# EAGLE design brain (EAGLE 9.6.1)
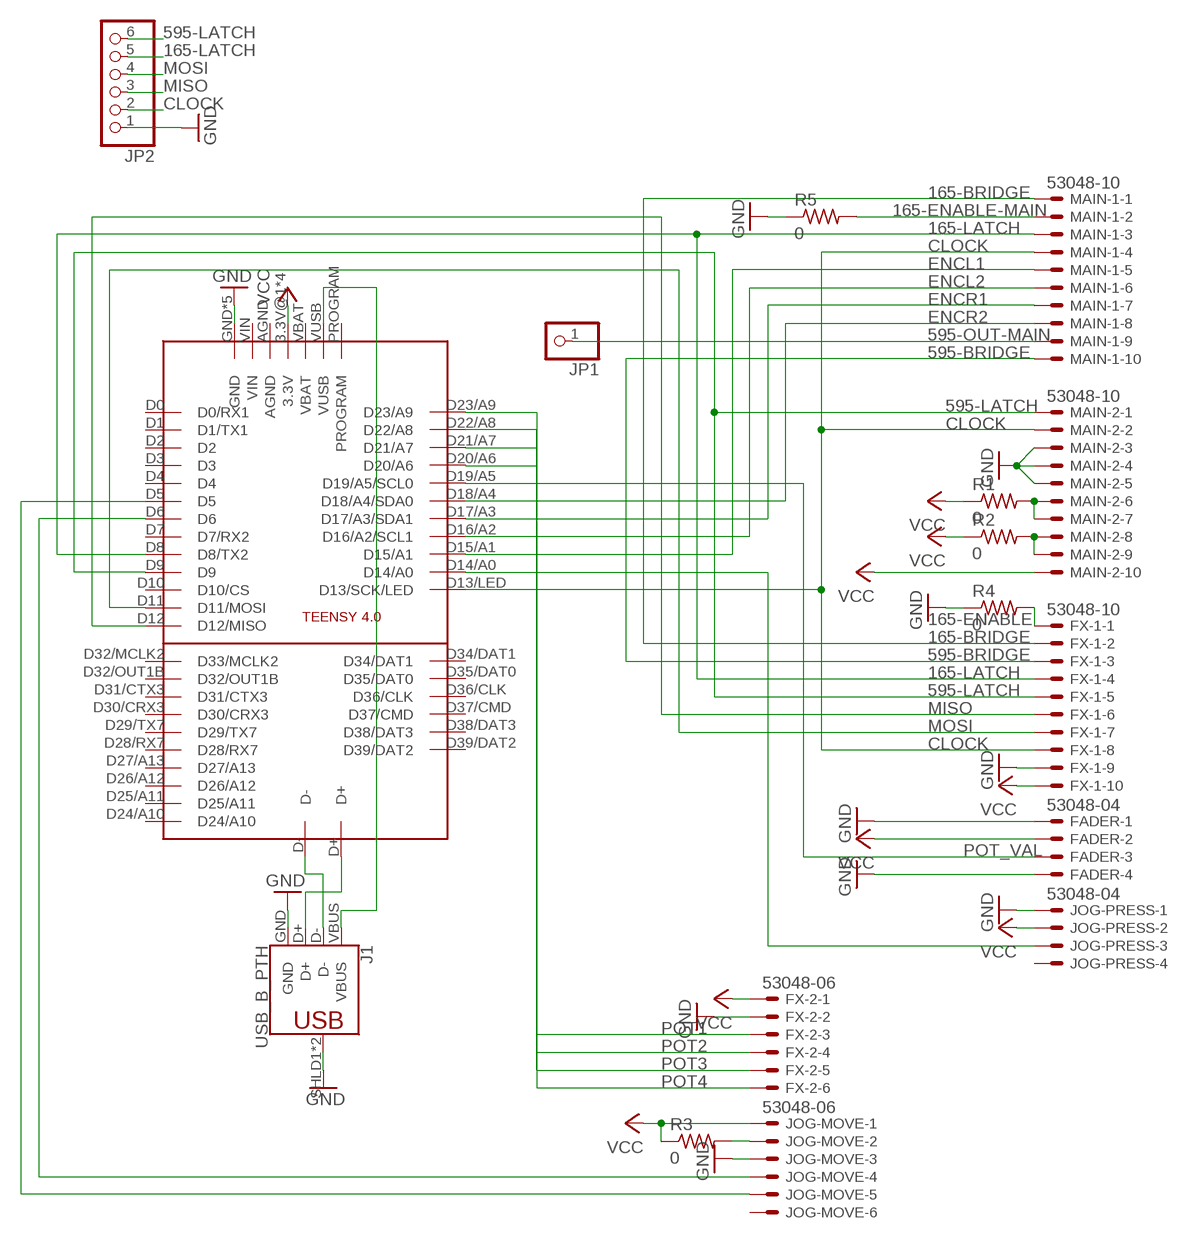
[diagram p0: schematic, sheet 1]

## Parts
FADER  53048-04  [53048-04]
FX-1  53048-10  [53048-10]
FX-2  53048-06  [53048-06]
J1  USB_B_PTH  [USB-B-PTH]
JOG-MOVE  53048-06  [53048-06]
JOG-PRESS  53048-04  [53048-04]
JP1  PINHD-1X1  [1X01]
JP2  PINHD-1X6  [1X06]
MAIN-1  53048-10  [53048-10]
MAIN-2  53048-10  [53048-10]
R1  0  R-US_R1206  [R1206]
R2  0  R-US_R1206  [R1206]
R3  0  R-US_R1206  [R1206]
R4  0  R-US_R1206  [R1206]
R5  0  R-US_R1206  [R1206]
U$1  TEENSY-4.0-FULL-BRAKE-PADS  [TEENSY-4.0-FULL-BRAKE-PADS]

## Nets
165-BRIDGE: FX-1.2 MAIN-1.1
165-ENABLE: FX-1.1 R4.2
165-ENABLE-MAIN: MAIN-1.2 R5.2
165-LATCH: FX-1.4 JP2.5 MAIN-1.3 U$1.D8(D8/TX2)
595-BRIDGE: FX-1.3 MAIN-1.10
595-LATCH: FX-1.5 JP2.6 MAIN-2.1 U$1.D9
595-OUT-MAIN: JP1.1 MAIN-1.9
CLOCK: FX-1.8 JP2.2 MAIN-1.4 MAIN-2.2 U$1.D13/LED(D13/SCK/LED)
ENCL1: MAIN-1.5 U$1.D15/A1
ENCL2: MAIN-1.6 U$1.D16/A2(D16/A2/SCL1)
ENCR1: MAIN-1.7 U$1.D17/A3(D17/A3/SDA1)
ENCR2: MAIN-1.8 U$1.D18/A4(D18/A4/SDA0)
GND: FADER.1 FADER.4 FX-1.9 FX-2.2 J1.GND J1.SHLD1(SHIELD) J1.SHLD2(SHIELD) JOG-MOVE.3 JOG-PRESS.1 JP2.1 MAIN-2.3 MAIN-2.4 MAIN-2.5 R4.1 R5.1 U$1.GND U$1.GND@1(GND) U$1.GND@2(GND) U$1.P$11(GND) U$1.P$12(GND)
MISO: FX-1.6 JP2.3 U$1.D12(D12/MISO)
MOSI: FX-1.7 JP2.4 U$1.D11(D11/MOSI)
N$1: MAIN-2.8 MAIN-2.9 R2.2
N$2: MAIN-2.6 MAIN-2.7 R1.2
N$3: JOG-PRESS.3 U$1.D14/A0
N$4: JOG-MOVE.2 R3.2
N$5: JOG-MOVE.4 U$1.D6
N$6: JOG-MOVE.5 U$1.D5
N$7: J1.D+ U$1.D+
N$8: J1.D- U$1.D-
N$9: J1.VBUS U$1.VUSB
POT1: FX-2.3 U$1.D20/A6
POT2: FX-2.4 U$1.D21/A7
POT3: FX-2.5 U$1.D22/A8
POT4: FX-2.6 U$1.D23/A9
POT_VAL: FADER.3 U$1.D19/A5(D19/A5/SCL0)
VCC: FADER.2 FX-1.10 FX-2.1 JOG-MOVE.1 JOG-PRESS.2 MAIN-2.10 R1.1 R2.1 R3.1 U$1.3.3V@1(3.3V) U$1.3.3V@2(3.3V) U$1.3V3(3.3V) U$1.ON/OFF(3.3V)
Unconnected: JOG-MOVE.6 JOG-PRESS.4 U$1.AGND U$1.D0(D0/RX1) U$1.D1(D1/TX1) U$1.D2 U$1.D3 U$1.D4 U$1.D7(D7/RX2) U$1.D10(D10/CS) U$1.D24/A10 U$1.D25/A11 U$1.D26/A12 U$1.D27/A13 U$1.D28/RX7 U$1.D29/TX7 U$1.D30/CRX3 U$1.D31/CTX3 U$1.D32/MCLK2(D33/MCLK2) U$1.D32/OUT1B U$1.D34/DAT1 U$1.D35/DAT0 U$1.D36/CLK U$1.D37/CMD U$1.D38/DAT3 U$1.D39/DAT2 U$1.PROGRAM U$1.VBAT U$1.VIN

## Library data of the parts
FADER JOG-PRESS = con-molex:53?-04: CONNECTOR wire to board 1.25 mm (.049 inch) pitch header; MF: MOLEX; MPN: 53048-0410; OC_FARNELL: 1462887; OC_NEWARK: 57H4721
FX-1 MAIN-1 MAIN-2 = con-molex:53?-10: CONNECTOR wire to board 1.25 mm (.049 inch) pitch header; MF: MOLEX; MPN: 53048-1010; OC_FARNELL: 9733108; OC_NEWARK: 98K9838
FX-2 JOG-MOVE = con-molex:53?-06: CONNECTOR wire to board 1.25 mm (.049 inch) pitch header; MF: WALDOM/MOLEX; MPN: 53048-0610; OC_FARNELL: 1012260; OC_NEWARK: 38C9911
J1 = SparkFun-Connectors:USB_B: USB Type B Connector SparkFun Products: SparkFun Stepoko <https://www.sparkfun.com/products/13899> PTH; PROD_ID: CONN-08278; SF_ID: PRT-00139
JP1 = pinhead:PINHD-1X1: PIN HEADER
JP2 = pinhead:PINHD-1X6: PIN HEADER
R1-R5 = adafruit:R-US_: RESISTOR, American symbol
U$1 = Teensy-4.0:TEENSY-4.0-FULL-BRAKE-PADS

## Board
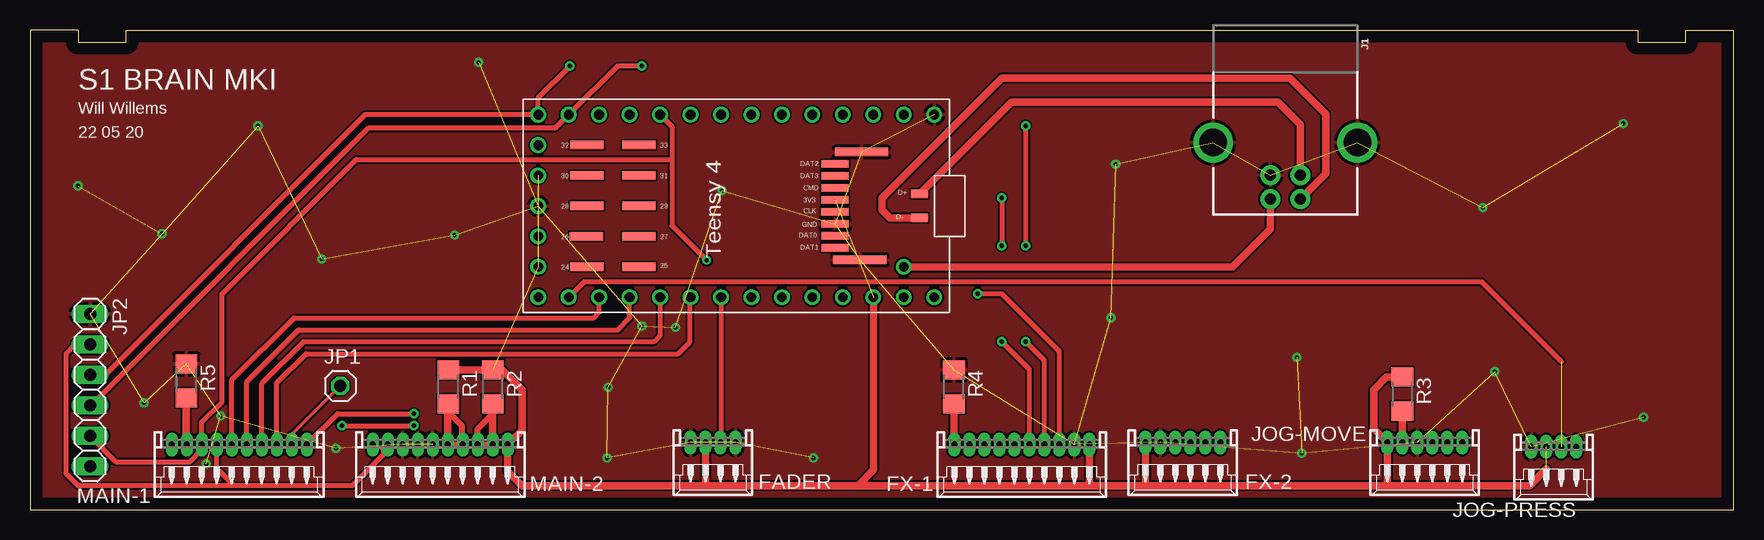
[diagram p1: board, top side]
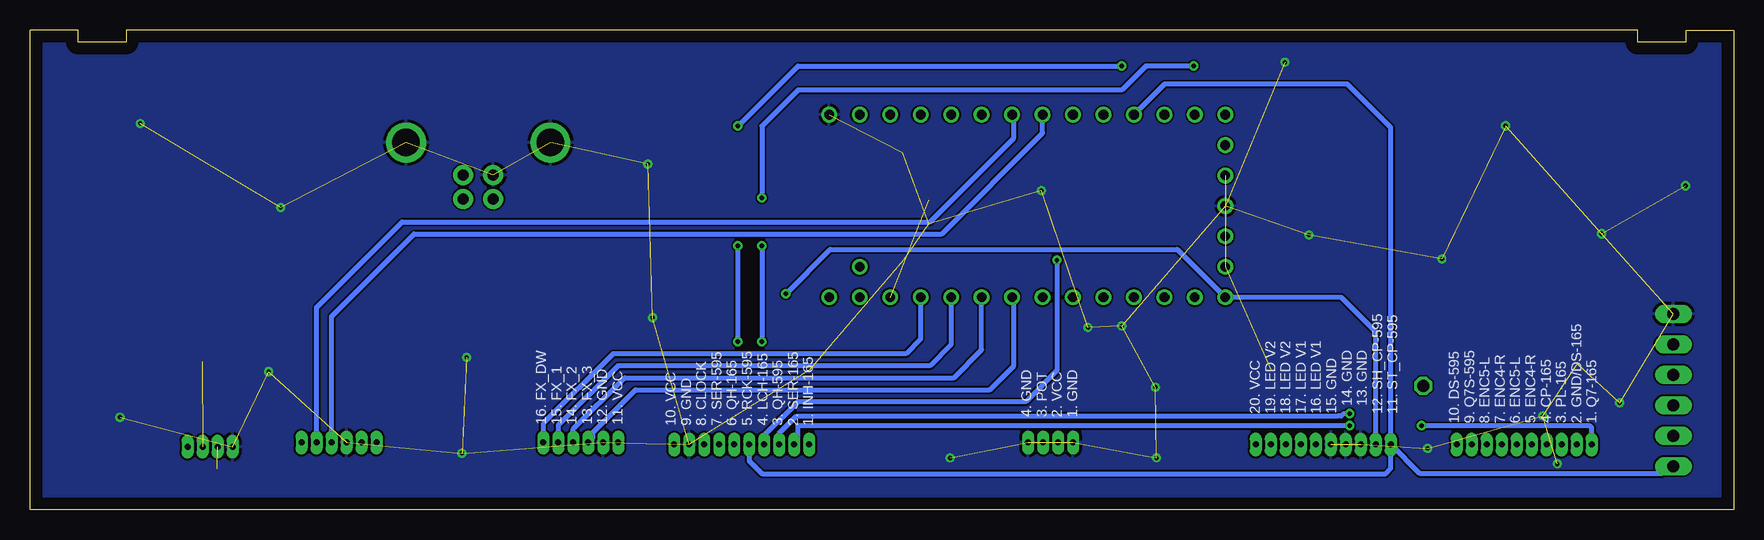
[diagram p2: board, bottom side, seen from below]

Size 142 x 40 mm. Coordinates in mm from the lower left corner, seen from the top.
Outline: 0,0 142,0 142,40 138,40 138,39 134,39 134,40 8,40 8,39 4,39 4,40 0,40 0,0
Copper layers (1*16): Top 0.035mm / dielectric 1.5mm / Bottom 0.035mm
Design rules "default": minimum track width 6mil, minimum drill 0.35mm, track to track 6mil, track to pad 6mil, pad to pad 6mil, via to via 6mil, smd to smd 6mil, copper to edge 40mil, drill to drill 6mil, minimum pad ring 10mil, minimum via ring 8mil, stop-mask expansion 4mil, vias tented up to drill 0mil, thermal gap 10mil

### Footprints (pad centres in the part's own frame; a part is rotated, then mirrored left to right if it is on the bottom)
53048-04 = drill 0.5 pad 0.698 long: 1 1.875,-1.25; 2 0.625,-1.25; 3 -0.625,-1.25; 4 -1.875,-1.25
53048-10 = drill 0.5 pad 0.698 long: 1 5.625,-1.25; 2 4.375,-1.25; 3 3.125,-1.25; 4 1.875,-1.25; 5 0.625,-1.25; 6 -0.625,-1.25; 7 -1.875,-1.25; 8 -3.125,-1.25; 9 -4.375,-1.25; 10 -5.625,-1.25
53048-06 = drill 0.5 pad 0.698 long: 1 3.125,-1.25; 2 1.875,-1.25; 3 0.625,-1.25; 4 -0.625,-1.25; 5 -1.875,-1.25; 6 -3.125,-1.25
USB-B-PTH = drill 0.914 pad 1.676: D+ 4,1.25; D- 5.981,1.25; GND 4,-1.25; VBUS 5.981,-1.25 | drill 2.286: SHLD1 1.282,-6.02; SHLD2 1.282,6.02
1X01 = drill 1.016 octagon: 1 0,0
1X06 = drill 1.016 long: 1 -6.35,0; 2 -3.81,0; 3 -1.27,0; 4 1.27,0; 5 3.81,0; 6 6.35,0
R1206 = smd 1.6 x 1.803: 1 -1.422,0; 2 1.422,0
TEENSY-4.0-FULL-BRAKE-PADS = drill 0.8: 3.3V@1 7.62,10.16; 3.3V@2 -2.54,-17.78; AGND 7.62,12.7; D0 -7.62,12.7; D1 -7.62,10.16; D2 -7.62,7.62; D3 -7.62,5.08; D4 -7.62,2.54; D5 -7.62,0; D6 -7.62,-2.54; D7 -7.62,-5.08; D8 -7.62,-7.62; D9 -7.62,-10.16; D10 -7.62,-12.7; D11 -7.62,-15.24; D12 -7.62,-17.78; D13/LED 7.62,-17.78; D14/A0 7.62,-15.24; D15/A1 7.62,-12.7; D16/A2 7.62,-10.16; D17/A3 7.62,-7.62; D18/A4 7.62,-5.08; D19/A5 7.62,-2.54; D20/A6 7.62,0; D21/A7 7.62,2.54; D22/A8 7.62,5.08; D23/A9 7.62,7.62; GND@1 -7.62,15.24; GND@2 0,-17.78; ON/OFF 5.08,-17.78; PROGRAM 2.54,-17.78; VBAT -5.08,-17.78; VIN 7.62,15.24; VUSB 5.08,12.7 | smd 0.635 x 2.286: 3V3 -0.508,6.965; D34/DAT1 3.492,6.965; D35/DAT0 2.492,6.965; D36/CLK 0.492,6.935; D37/CMD -1.508,6.965; D38/DAT3 -2.508,6.965; D39/DAT2 -3.508,6.965; GND 1.492,6.965 | smd 0.711 x 2.794: D24/A10 5.08,-13.716; D25/A11 5.08,-9.398; D26/A12 2.54,-13.767; D27/A13 2.54,-9.398; D28/RX7 0,-13.716; D29/TX7 0,-9.398; D30/CRX3 -2.54,-13.716; D31/CTX3 -2.54,-9.398; D32/MCLK2 -5.08,-9.398; D32/OUT1B -5.08,-13.716 | smd 0.711 x 1.422: D+ -1,14; D- 1,14 | smd 0.711 x 4.445: P$11 4.492,9.036; P$12 -4.508,9.176

### Placement (x,y rotation side)
FADER  56.93,4.34 180 top
FX-1  82.68,4.18 180 top
FX-2  96.09,4.34 180 top
J1  104.63,31.89 270 top
JOG-MOVE  116.25,4.34 180 top
JOG-PRESS  127,4 180 top
JP1  25.86,10.31 0 top
JP2  5.01,9.96 270 top
MAIN-1  17.44,4.18 180 top
MAIN-2  34.2,4.18 180 top
R1  34.86,10.23 270 top
R2  38.58,10.23 270 top
R3  114.4,9.63 270 top
R4  77.02,10.23 270 top
R5  13.04,10.73 270 top
U$1  60.14,25.32 270 top

### Tracks (layer width: path | path; a pad name or v marks a point on that pad's centre or on a via)
165-BRIDGE  (via drill 0.35)
  Top 0.406: v26,7 v32,7
  Bottom 0.406: FX-1.2 78,5.74 78,7 v32,7 | MAIN-1.1 11.81,6.82 12,7 v26,7
165-ENABLE
  Top 0.61: FX-1.1 77.02,5.46 R4.2
165-ENABLE-MAIN
  Top 0.61: MAIN-1.2 13.04,5.46 R5.2
165-LATCH  (via drill 0.35)
  Top 0.406: JP2.5 7.16,4 13.36,4 14.31,4.96 MAIN-1.3 14.31,7.32 16,9 16,18 27.2,29.2 53.52,29.2 | 53.52,29.2 53.52,28.52 53.52,23.68 v56.4,20.8 | U$1.D8 53.52,31.94 53.52,29.2
  Bottom 0.406: v56.4,20.8 56.4,11.6 59,9 78,9 80.81,6.2 FX-1.4
595-BRIDGE  (via drill 0.35)
  Top 0.406: MAIN-1.10 25.64,8 v32,8
  Bottom 0.406: FX-1.3 79.56,6.34 78.1,7.8 33,7.8 32.7,7.8 32.5,8 v32,8
595-LATCH
  Bottom 0.406: JP2.6 5.39,3.61 6,3 26.14,3 MAIN-2.1 | MAIN-2.1 28.57,31.88 32.2,35.5 47.42,35.5 U$1.D9 | FX-1.5 82.06,4.05 81,3 29,3 28.57,3.42 MAIN-2.1
595-OUT-MAIN
  Top 0.305: 21.82,6.26 JP1.1
  Top 0.406: MAIN-1.9 21.82,6.26
CLOCK  (via drill 0.35)
  Top 0.406: MAIN-2.2 29.43,5.04 29.43,4.57 26.86,2 17,2 | 17,2 15.56,3.44 MAIN-1.4 | 17,2 4,2 3,3 3,13 3.77,13.77 JP2.2 | FX-1.8 85.81,13.2 81,18 v79,18
  Bottom 0.406: MAIN-2.2 29.82,14.82 32.7,17.7 U$1.D13/LED 46.36,21.7 75.3,21.7 v79,18
ENCL1
  Top 0.406: MAIN-1.5 16.82,10.81 22,16 47,16 47.44,16.44 U$1.D15/A1
ENCL2
  Top 0.406: MAIN-1.6 18.07,10.66 22.4,15 49,15 49.98,15.98 U$1.D16/A2
ENCR1
  Top 0.406: MAIN-1.7 19.32,10.52 22.8,14 52,14 52.52,14.52 U$1.D17/A3
ENCR2
  Top 0.406: MAIN-1.8 20.57,10.56 23,13 54,13 55,14 55,17.64 U$1.D18/A4
GND  (via drill 0.35)  (43 unrouted)
  other vias: 11,23 19,32 4,27 9.5,8.9 24.3,20.9 35.4,22.9 37.4,37.3 48.2,10.2 48.1,4.3 65.3,4.3 90.5,28.8 90.1,16 105.6,12.7 106,4.7 122.1,11.5 121.1,25.2 132.8,32.2 134.5,7.7 57.7,26.6 51,15.3 53.8,15.2 25.5,5.1 15.9,7.8 14.7,3.8
  pour Bottom: -1,-1 -1,41 143,41 143,-1
  pour Top: -1,-1 143,-1 143,41 -1,41
MISO  (via drill 0.35)
  Top 0.406: JP2.3 5.24,11 6,11 27.94,32.94 U$1.D12 42.36,34.36 v45,37 | FX-1.6 83.31,11.7 v81,14 | v81,26 v81,22
  Bottom 0.406: v45,37 49,37 51,35 78,35 81,32 v81,26 | v81,22 v81,14
MOSI  (via drill 0.35)
  Top 0.406: JP2.4 5.09,8.69 28.2,31.8 43.76,31.8 U$1.D11 48.96,37 v51,37 | FX-1.7 84.56,12.45 v83,14 | v83,22 v83,32
  Bottom 0.406: v83,14 v83,22 | v83,32 78,37 v51,37
N$1
  Top 0.508: MAIN-2.9 MAIN-2.8 37.33,6.75 38.58,8
  Top 0.61: MAIN-2.9 38.58,8 R2.2
N$2
  Top 0.508: MAIN-2.6 MAIN-2.7 36,5.5 36,7 35,8 34.83,8
  Top 0.61: MAIN-2.6 34.83,8 34.83,8.77 R1.2
N$3  (1 unrouted)
  Top 0.406: U$1.D14/A0 46.2,19 121,19 127.66,12.34
N$4
  Top 0.61: JOG-MOVE.2 114.38,8.18 R3.2
N$5
  Bottom 0.406: JOG-MOVE.4 116.88,16.12 110,23 66,23 57.6,31.4 U$1.D6
N$6
  Bottom 0.406: JOG-MOVE.5 118.12,16.88 111,24 67,24 60,31 60,32.8 U$1.D5
N$7
  Top 0.61: J1.D+ 105.88,32.12 104,34 81.82,34 U$1.D+
N$8
  Top 0.61: J1.D- 108,28.03 108,33 105,36 81,36 71,26 71,25 71.68,24.32 U$1.D-
N$9
  Top 0.61: U$1.VUSB 100.24,20.24 103.38,23.38 J1.VBUS
POT1
  Bottom 0.406: FX-2.3 95.08,5.98 95.08,6.45 91.53,10 62,10 60,12 60,17.56 U$1.D20/A6
POT2
  Bottom 0.406: FX-2.4 96.72,6.71 92.43,11 65,11 62.68,13.32 U$1.D21/A7
POT3
  Bottom 0.406: U$1.D22/A8 65.22,13.78 67,12 93,12 97.97,7.04 FX-2.5
POT4
  Bottom 0.406: U$1.D23/A9 67.76,14.24 69,13 93.4,13 99.22,7.18 FX-2.6
POT_VAL
  Top 0.406: U$1.D19/A5 57.6,5.63
  Top 0.61: 57.6,5.63 FADER.3
VCC  (4 unrouted)
  Top 0.61: 126.41,3.41 125,2 113.12,2 | 113.12,2 92.97,2 | 92.97,2 88.31,2 | 88.31,2 69,2 | 69,2 56.3,2 | 56.3,2 41,2 39.83,3.17 MAIN-2.10 41,6.61 41,10 39.35,11.65 R2.1 R1.1 | FADER.2 56.3,2 | FX-1.10 88.31,2 | FX-2.1 92.97,2 | 113.12,2 JOG-MOVE.1 112,6.71 112,10 113.05,11.05 R3.1 | U$1.3.3V@1 70.3,3.3 69,2

### Text on the board
tPlace: S1 BRAIN MKI | Will Willems | 22 05 20
bPlace: 20. VCC / 19. LED V2 / 18. LED V2 / 17. LED V1 / 16. LED V1 / 15. GND / 14. GND / 13. GND / 12. SH_CP-595 / 11. ST_CP-595 | 4. GND / 3. POT / 2. VCC / 1. GND | 10. DS-595 / 9. Q7S-595 / 8. ENC5-L / 7. ENC4-R / 6. ENC5-L / 5. ENC4-R / 4. CP-165 / 3. PL-165 / 2. GND/DS-165 / 1. Q7-165 | 10. VCC / 9. GND / 8. CLOCK / 7. SER-595 / 6. QH-165 / 5. RCK-595 / 4. LCH-165 / 3. QH-595 / 2. SER-165 / 1. INH-165 | 16. FX_DW / 15. FX_1 / 14. FX_2 / 13. FX_3 / 12. GND / 11. VCC